# EAGLE design connector_shield (EAGLE 6.5.0)
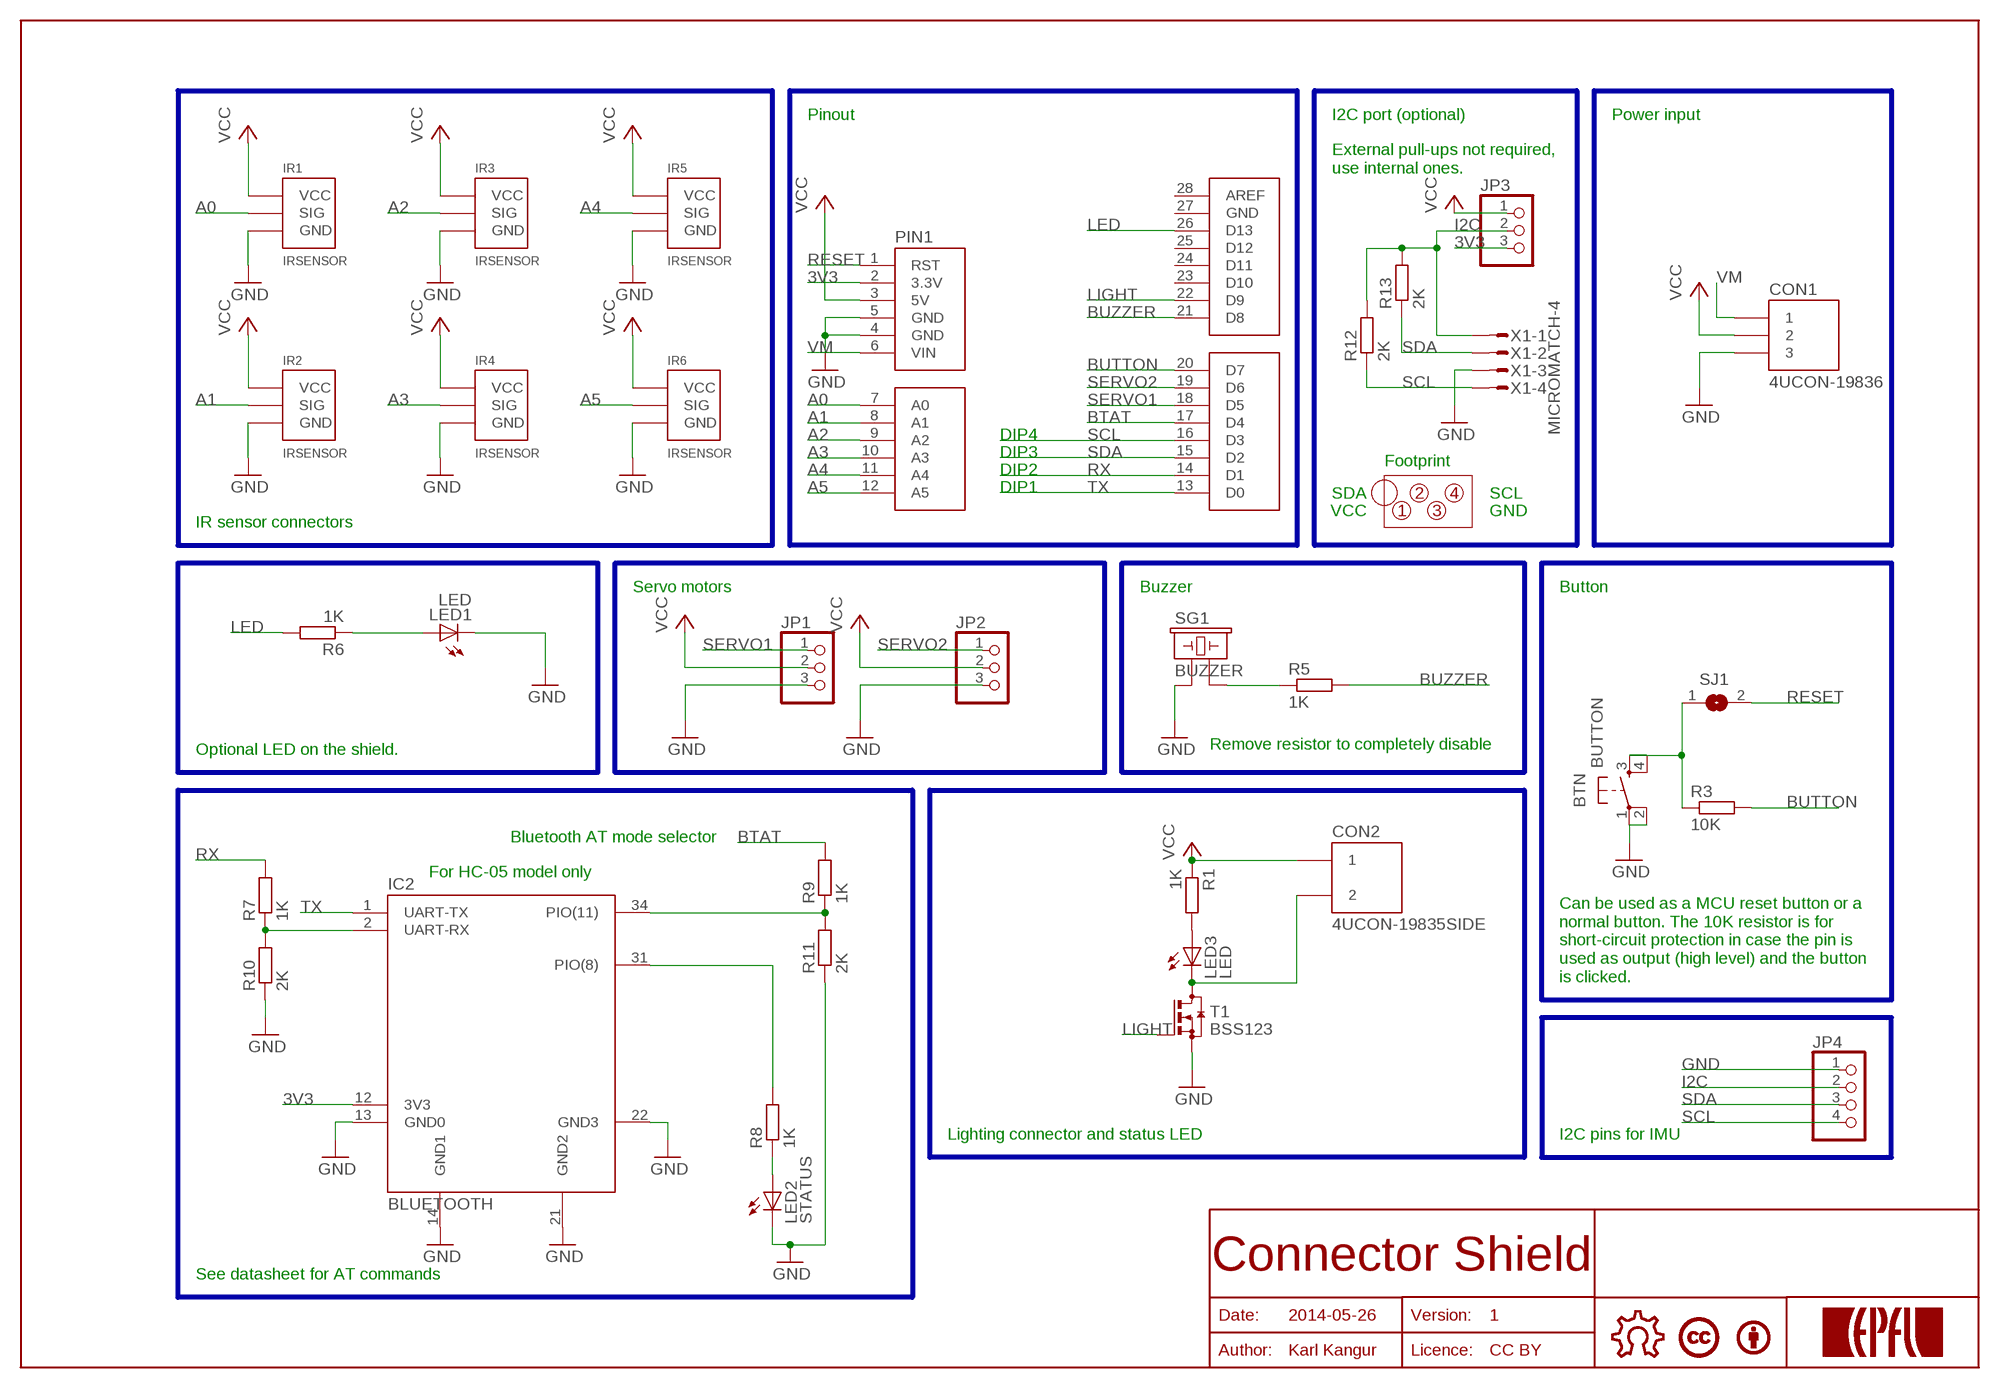
[diagram p0: schematic, sheet 1]

## Parts
BTN  BUTTON  [BUTTON]
BY1  BYBOTTOM  [BY]
CON1  4UCON-19836  [4UCON-19836]
CON2  4UCON-19835SIDE  [4UCON-19835]
IC2  BLUETOOTH  [BLUETOOTH]
IR1  IRSENSOR  [A-6373-03]
IR2  IRSENSOR  [A-6373-03]
IR3  IRSENSOR  [A-6373-03]
IR4  IRSENSOR  [A-6373-03]
IR5  IRSENSOR  [A-6373-03]
IR6  IRSENSOR  [A-6373-03]
JP1  PINHD-1X3  [1X03]
JP2  PINHD-1X3  [1X03]
JP3  PINHD-1X3  [1X03]
JP4  PINHD-1X4  [1X04]
LED1  LED  LEDCHIPLED_0805  [CHIPLED_0805]
LED2  STATUS  LEDCHIPLED_0805  [CHIPLED_0805]
LED3  LED  LEDCHIPLED_0805  [CHIPLED_0805]
LICENCE1  LICENCECC-BOTTOM  [CREATIVE-COMMONS]
PIN1  ARDUINOSTACK  [ARDUINO-LONG]
R1  1K  R-EU_R0805  [R0805]
R3  10K  R-EU_R0805  [R0805]
R5  1K  R-EU_R0805  [R0805]
R6  1K  R-EU_R0805  [R0805]
R7  1K  R-EU_R0805  [R0805]
R8  1K  R-EU_R0805  [R0805]
R9  1K  R-EU_R0805  [R0805]
R10  2K  R-EU_R0805  [R0805]
R11  2K  R-EU_R0805  [R0805]
R12  2K  R-EU_R0805  [R0805]
R13  2K  R-EU_R0805  [R0805]
SG1  BUZZER  [PS1240P02BT]
SJ1  SJ  [SJ]
T1  BSS123  [SOT23]
U$10  OPEN-HARDWARE-LOGOBOTTOM-SMALL  [OPEN-HARDWARE-BOTTOM-SMALL]
U$11  EPFL-LOGO  [EPFL-LOGO-PCB]
X1  MICROMATCH-4  [MICROMATCH-4]

## Nets
3V3: IC2.12(3V3) JP3.3 PIN1.2(3.3V)
A0: IR1.SIG PIN1.7(A0)
A1: IR2.SIG PIN1.8(A1)
A2: IR3.SIG PIN1.9(A2)
A3: IR4.SIG PIN1.10(A3)
A4: IR5.SIG PIN1.11(A4)
A5: IR6.SIG PIN1.12(A5)
BTAT: PIN1.17(D4) R9.2
BUTTON: PIN1.20(D7) R3.2
BUZZER: PIN1.21(D8) R5.2
GND: BTN.1 BTN.2 CON1.3 IC2.13(GND0) IC2.14(GND1) IC2.21(GND2) IC2.22(GND3) IR1.GND IR2.GND IR3.GND IR4.GND IR5.GND IR6.GND JP1.3 JP2.3 JP4.1 LED1.C LED2.C PIN1.4(GND) PIN1.5(GND) R10.1 R11.1 SG1.P$1 T1.2(S) X1.3
I2C: JP3.2 JP4.2 R12.2 R13.2 X1.1
LED: PIN1.26(D13) R6.2
LIGHT: PIN1.22(D9) T1.1(G)
N$1: CON2.2 LED3.C T1.3(D)
N$2: IC2.31(PIO(8)) R8.2
N$3: LED2.A R8.1
N$4: LED3.A R1.2
N$7: R5.1 SG1.P$2
N$8: IC2.34(PIO(11)) R9.1 R11.2
N$13: LED1.A R6.1
N$18: BTN.3 BTN.4 R3.1 SJ1.1
N$27: IC2.2(UART-RX) R7.1 R10.2
RESET: PIN1.1(RST) SJ1.2
RX: PIN1.14(D1) R7.2
SCL: JP4.4 PIN1.16(D3) R12.1 X1.4
SDA: JP4.3 PIN1.15(D2) R13.1 X1.2
SERVO1: JP1.1 PIN1.18(D5)
SERVO2: JP2.1 PIN1.19(D6)
TX: IC2.1(UART-TX) PIN1.13(D0)
VCC: CON1.2 CON2.1 IR1.VCC IR2.VCC IR3.VCC IR4.VCC IR5.VCC IR6.VCC JP1.2 JP2.2 JP3.1 PIN1.3(5V) R1.1
VM: CON1.1 PIN1.6(VIN)
Unconnected: PIN1.23(D10) PIN1.24(D11) PIN1.25(D12) PIN1.28(AREF)

## Buses
B$1
B$2
B$7
B$8
B$9
B$11
B$12
B$4
B$3
B$5

## Notes on the sheet
- Pinout | I2C port (optional) | Power input
- External pull-ups not required,
  use internal ones.
- DIP4
- DIP3
- Footprint
- DIP2
- DIP1 | SDA | 2 | 4 | SCL
- VCC | 1 | 3 | GND
- IR sensor connectors
- Servo motors | Buzzer | Button
- Remove resistor to completely disable
- Optional LED on the shield.
- Bluetooth AT mode selector
- For HC-05 model only
- Can be used as a MCU reset button or a
  normal button. The 10K resistor is for
  short-circuit protection in case the pin is
  used as output (high level) and the button
  is clicked.
- Lighting connector and status LED | I2C pins for IMU
- Connector Shield
- See datasheet for AT commands
- Date: | 2014-05-26 | Version: | 1
- Author: | Karl Kangur | Licence: | CC BY

## Power pins joined to a net without a drawn wire
GND: PIN1.27(GND)

## Library data of the parts
BTN = robopoly:BUTTON
BY1 = robopoly:BY
CON1 = robopoly:4UCON-19836
CON2 = karl_new:4UCON-19835
IC2 = robopoly:BLUETOOTH
IR1-IR6 = karl_new:IRSENSOR
JP1 JP2 = robopoly:PINHD-1X3: PIN HEADER
JP3 = pinhead:PINHD-1X3: PIN HEADER
JP4 = pinhead:PINHD-1X4: PIN HEADER
LED1-LED3 = led:LED: LED OSRAM: - CHIPLED LG R971, LG N971, LY N971, LG Q971, LY Q971, LO R971, LY R971 LH N974, LH R974 LS Q976, LO Q976, LY Q976 LO Q996 - Hyper CHIPLED LW Q18S LB Q993, LB Q99A, LB R99A - SideLED LS A670, LO A670, LY A670, LG A670, LP A670 LB A673, LV A673, LT A673, LW A673 LH A674 LY A675 LS A676, LA A676, LO A676, LY A676, LW A676 LS A679, LY A679, LG A679 - Hyper Micro SIDELED® LS Y876, LA Y876, LO Y876, LY Y876 LT Y87S - SmartLED LW L88C, LW L88S LB L89C, LB L89S, LG L890 LS L89K, LO L89K, LY L89K LS L896, LA L896, LO L896, LY L896 - TOPLED LS T670, LO T670, LY T670, LG T670, LP T670 LSG T670, LSP T670, LSY T670, LOP T670, LYG T670 LG T671, LOG T671, LSG T671 LB T673, LV T673, LT T673, LW T673 LH T674 LS T676, LA T676, LO T676, LY T676, LB T676, LH T676, LSB T676, LW T676 LB T67C, LV T67C, LT T67C, LS T67K, LO T67K, LY T67K, LW E67C LS E67B, LA E67B, LO E67B, LY E67B, LB E67C, LV E67C, LT E67C LW T67C LS T679, LY T679, LG T679 LS T770, LO T770, LY T770, LG T770, LP T770 LB T773, LV T773, LT T773, LW T773 LH T774 LS E675, LA E675, LY E675, LS T675 LS T776, LA T776, LO T776, LY T776, LB T776 LHGB T686 LT T68C, LB T68C - Hyper Mini TOPLED® LB M676 - Mini TOPLED Santana® LG M470 LS M47K, LO M47K, LY M47K Source: http://www.osram.convergy.de LUXEON: - LUMILED® LXK2-PW12-R00, LXK2-PW12-S00, LXK2-PW14-U00, LXK2-PW14-V00 LXK2-PM12-R00, LXK2-PM12-S00, LXK2-PM14-U00 LXK2-PE12-Q00, LXK2-PE12-R00, LXK2-PE12-S00, LXK2-PE14-T00, LXK2-PE14-U00 LXK2-PB12-K00, LXK2-PB12-L00, LXK2-PB12-M00, LXK2-PB14-N00, LXK2-PB14-P00, LXK2-PB14-Q00 LXK2-PR12-L00, LXK2-PR12-M00, LXK2-PR14-Q00, LXK2-PR14-R00 LXK2-PD12-Q00, LXK2-PD12-R00, LXK2-PD12-S00 LXK2-PH12-R00, LXK2-PH12-S00 LXK2-PL12-P00, LXK2-PL12-Q00, LXK2-PL12-R00 Source: www.luxeon.com KINGBRIGHT: KA-3528ASYC Source: www.kingbright.com
LICENCE1 = robopoly:LICENCE
PIN1 = robopoly:ARDUINO
R1 R3 R5-R13 = rcl:R-EU_: RESISTOR, European symbol
SG1 = robopoly:BUZZER: BUZZER Source: Buerklin; OC_FARNELL: unknown; OC_NEWARK: unknown
SJ1 = robopoly:SJ: SMD solder JUMPER
T1 = transistor-small-signal:BSS123: N-CHANNEL MOS FET
U$10 = robopoly:OPEN-HARDWARE-LOGO
U$11 = robopoly:EPFL-LOGO
X1 = robopoly:MICROMATCH-4: MicroMaTch 4 7-215464-4 / 0-215464-4 Drawing Number C-215464 DDEController.pdf; MPN: 7-215464-4; OC_FARNELL: 3784629; OC_NEWARK: 19R8124

## Board
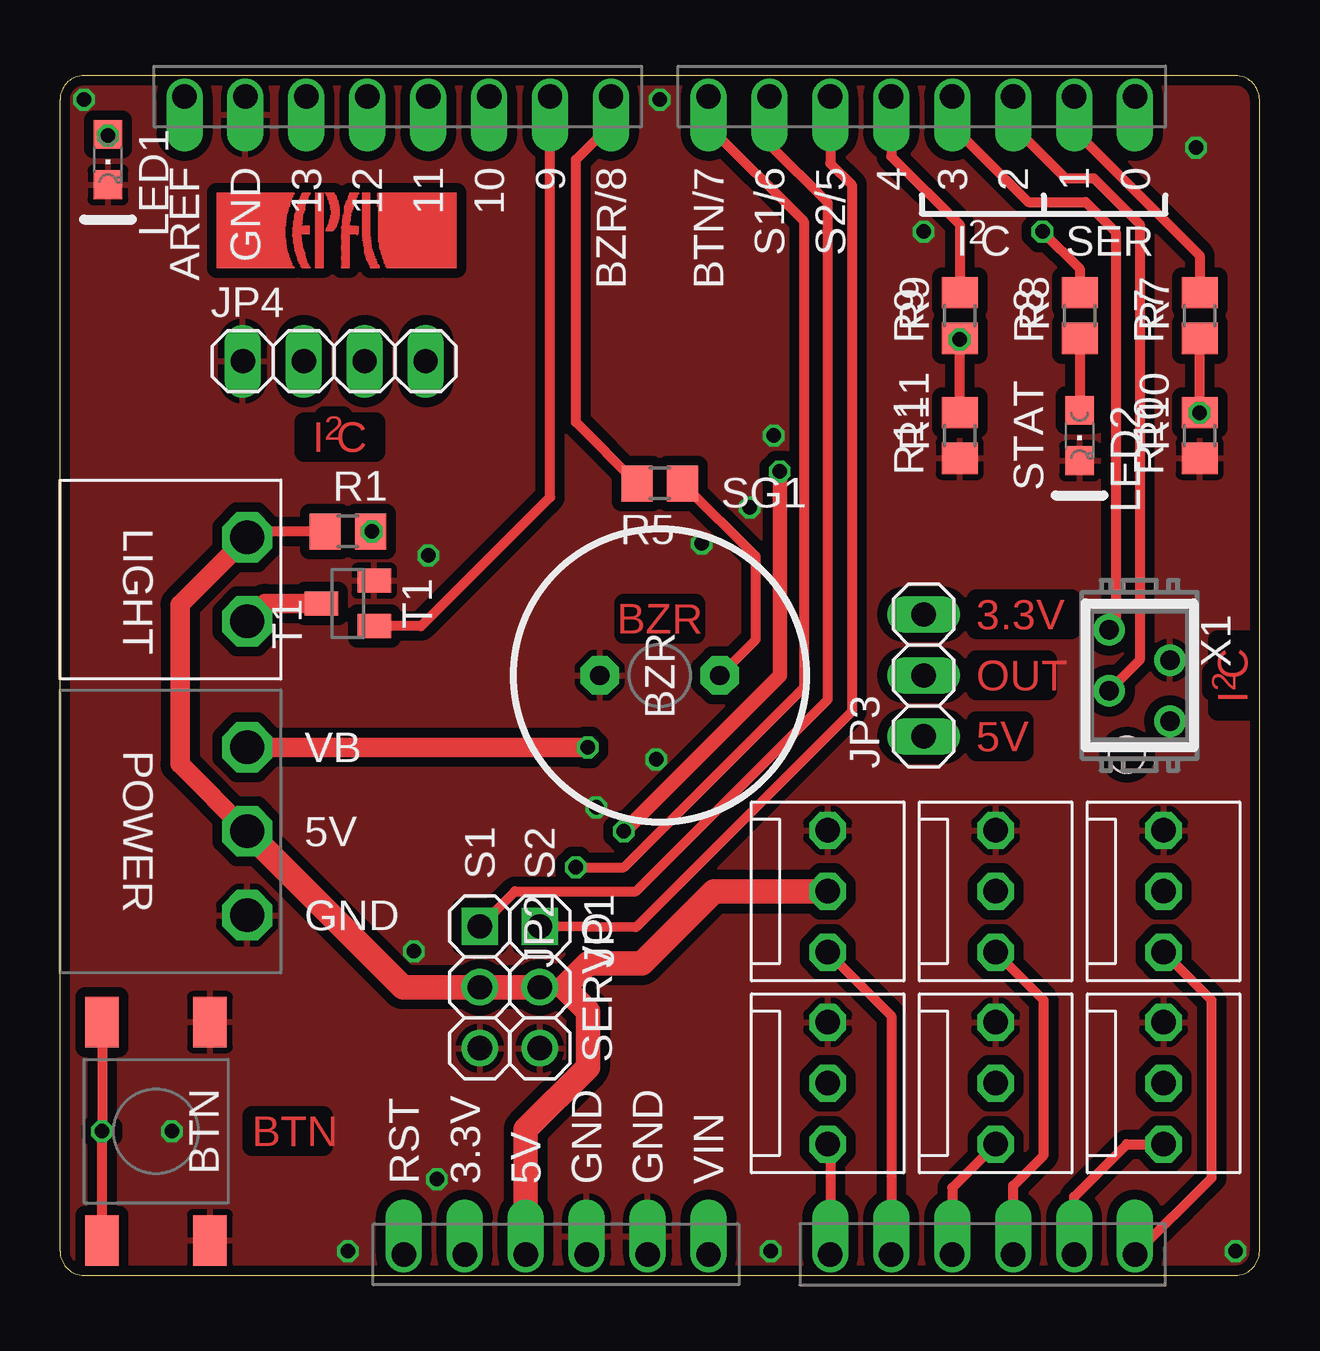
[diagram p1: board, top side]
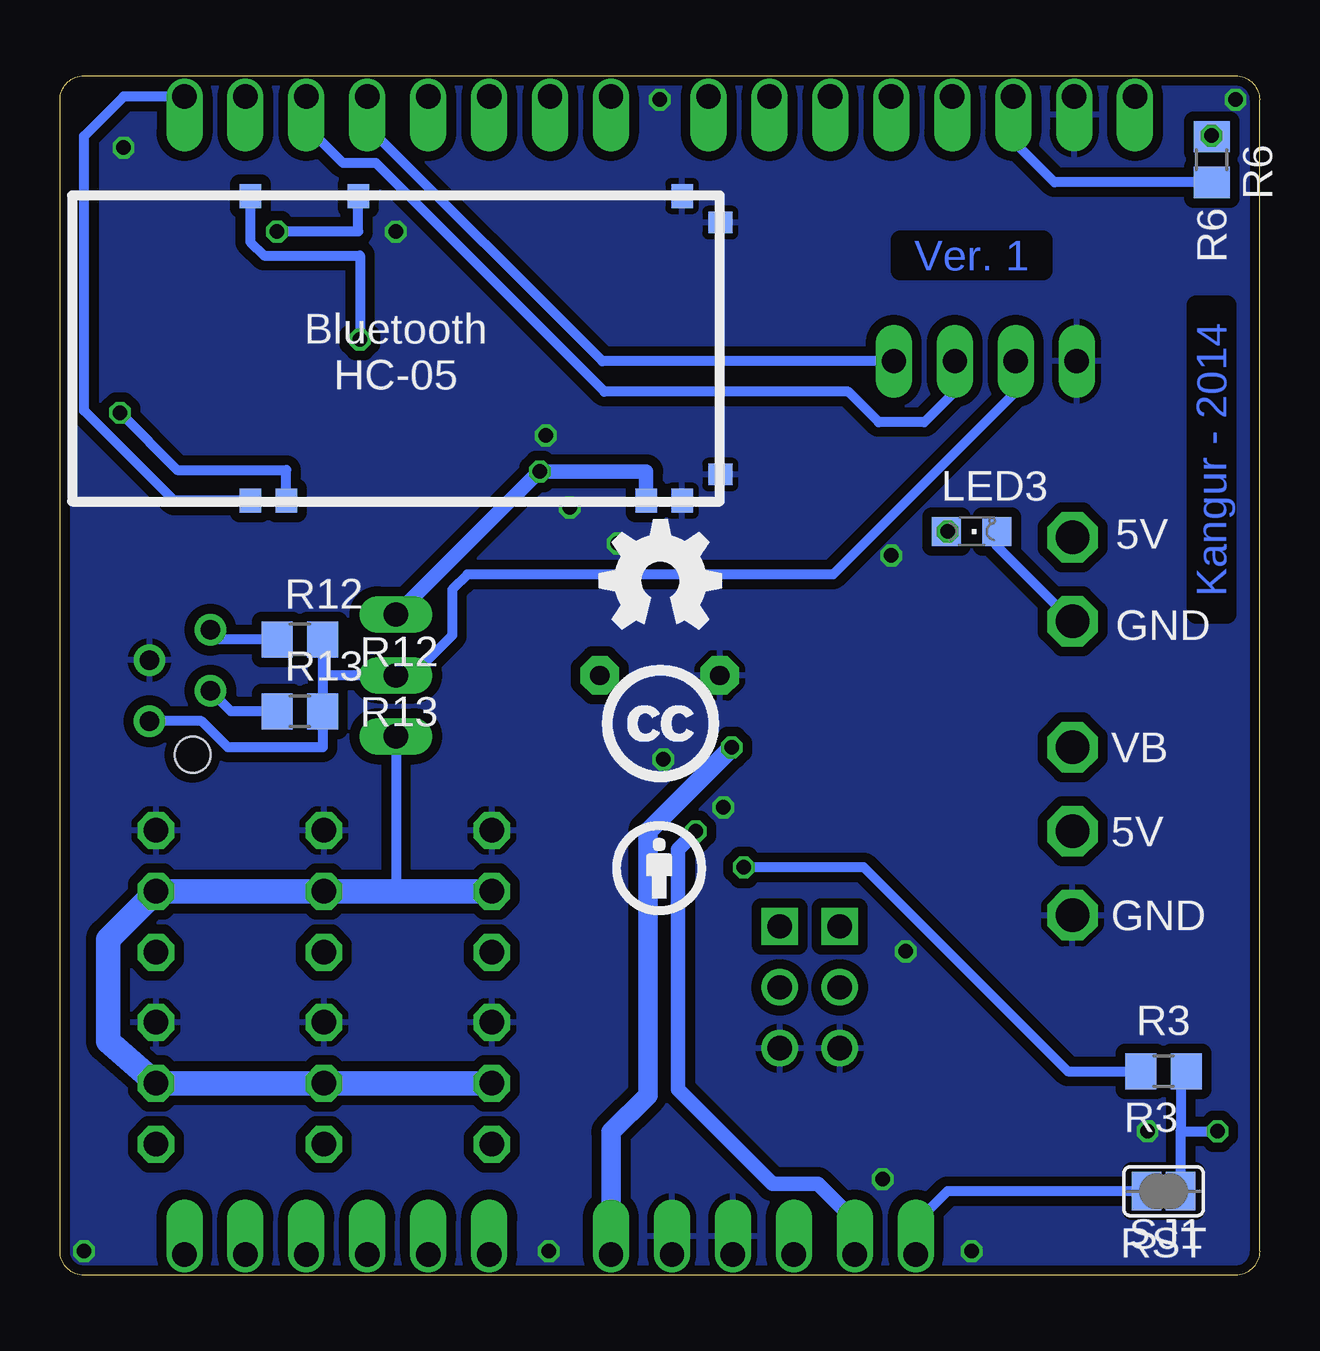
[diagram p2: board, bottom side, seen from below]

Size 50 x 50 mm. Coordinates in mm from the lower left corner, seen from the top.
Outline: 0,1 arc90 1,0 49,0 arc90 50,1 50,49 arc90 49,50 1,50 arc90 0,49 0,1
Copper layers (1*16): Top 0.035mm / dielectric 1.5mm / Bottom 0.035mm
Design rules "Fusion_eagle_rule_v1.1 *": minimum track width 0.1mm, minimum drill 0.3mm, track to track 0.15mm, track to pad 0.15mm, pad to pad 0.15mm, via to via 0.15mm, smd to smd 0mil, copper to edge 4mil, drill to drill 10mil, minimum pad ring 10mil, minimum via ring 6mil, stop-mask expansion 2mil, vias tented up to drill 100mil, thermal gap 10mil

### Footprints (pad centres in the part's own frame; a part is rotated, then mirrored left to right if it is on the bottom)
BUTTON = smd 1.4 x 2.1: 1 2.25,4.55; 2 2.25,-4.55; 3 -2.25,4.55; 4 -2.25,-4.55
4UCON-19836 = drill 1.4 octagon: 1 -3.5,7.8; 2 0,7.8; 3 3.5,7.8
4UCON-19835 = drill 1.4 octagon: 1 -1.75,7.8; 2 1.75,7.8
BLUETOOTH = smd 1 x 0.9: 1 -6.4,9.5; 2 -6.4,8; 12 -6.4,-7; 13 -6.4,-8.5; 22 6.3,-8.5; 31 6.3,5; 34 6.3,9.5 | smd 0.9 x 1: 14 -5.3,-10.1; 21 5.2,-10.1
A-6373-03 = drill 1.02 octagon: GND 2.54,0; SIG -2.54,0; VCC 0,0
1X03 = drill 1.016 square: 1 -2.54,0 | drill 1.016: 2 0,0; 3 2.54,0
1X03' = drill 1.016 long: 1 -2.54,0; 2 0,0; 3 2.54,0
1X04 = drill 1.016 long: 1 -3.81,0; 2 -1.27,0; 3 1.27,0; 4 3.81,0
CHIPLED_0805 = smd 1.2 x 1.2: A 0,-1.05; C 0,1.05
ARDUINO-LONG = drill 1.016 offset: 1 -10.668,-24.13; 2 -8.128,-24.13; 3 -5.588,-24.13; 4 -3.048,-24.13; 5 -0.508,-24.13; 6 2.032,-24.13; 7 7.112,-24.13; 8 9.652,-24.13; 9 12.192,-24.13; 10 14.732,-24.13; 11 17.272,-24.13; 12 19.812,-24.13; 13 19.812,24.13; 14 17.272,24.13; 15 14.732,24.13; 16 12.192,24.13; 17 9.652,24.13; 18 7.112,24.13; 19 4.572,24.13; 20 2.032,24.13; 21 -2.032,24.13; 22 -4.572,24.13; 23 -7.112,24.13; 24 -9.652,24.13; 25 -12.192,24.13; 26 -14.732,24.13; 27 -17.272,24.13; 28 -19.812,24.13
R0805 = smd 1.3 x 1.5: 1 -0.95,0; 2 0.95,0
PS1240P02BT = drill 0.8 pad 1.6 octagon: P$1 -2.5,0; P$2 2.5,0
SJ = smd 1.219 x 1.6: 1 -0.711,0; 2 0.711,0
SOT23 = smd 1 x 1.4: 1 -0.95,-1.1; 2 0.95,-1.1; 3 0,1.1
MICROMATCH-4 = drill 0.813: 1 1.905,1.27; 2 0.635,-1.27; 3 -0.635,1.27; 4 -1.905,-1.27 | hole 1.5: 3.305,-0.53

### Placement (x,y rotation side)
BTN  4,6 0 top
BY1  25,17 0 top
CON1  0,18.5 270 top
CON2  0,29 270 top
IC2  32.57,38.68 90 bottom
IR1  32,8 90 top
IR2  32,16 90 top
IR3  39,8 90 top
IR4  39,16 90 top
IR5  46,8 90 top
IR6  46,16 90 top
JP1  20,12 270 top
JP2  17.5,12 270 top
JP3  [1X03']  36,25 90 top
JP4  11.43,38.1 0 top
LED1  2,46.5 180 top
LED2  42.5,35 180 top
LED3  12,31 270 bottom
LICENCE1  25,23 0 top
PIN1  25,25 0 top
R1  12,31 0 top
R3  4,8.5 180 bottom
R5  25,33 180 top
R6  2,46.5 270 bottom
R7  47.5,40 90 top
R8  42.5,40 90 top
R9  37.5,40 90 top
R10  47.5,35 90 top
R11  37.5,35 90 top
R12  40,26.5 0 bottom
R13  40,23.5 0 bottom
SG1  25,25 0 top
SJ1  4,3.5 180 bottom
T1  12,28 90 top
U$10  25,29 0 top
U$11  6.55,42 0 top
X1  45,25 270 top

### Tracks (layer width: path | path; a pad name or v marks a point on that pad's centre or on a via)
3V3  (via drill 0.6)
  Top 0.61: v23.5,18.5 30,25 v30,33.5
  Bottom 0.406: 30.04,33.5 v30,33.5
  Bottom 0.61: IC2.12 25.57,33.5 v30,33.5 | v23.5,18.5 24.25,17.75 24.25,7.75 20.31,3.81 18.41,3.81 16.87,2.27 PIN1.2 | JP3.3 30.04,33.5
A0
  Top 0.406: IR1.SIG 32.11,5.35 PIN1.7
A1
  Top 0.406: IR2.SIG 34.65,10.81 PIN1.8
A2
  Top 0.406: IR3.SIG 37.19,3.65 PIN1.9
A3
  Top 0.406: PIN1.10 39.73,3.73 41,5 41,11.46 IR4.SIG
A4
  Top 0.406: PIN1.11 42.27,3.27 44.46,5.46 IR5.SIG
A5
  Top 0.406: PIN1.12 48,4.06 48,11.46 IR6.SIG
BTAT
  Top 0.406: PIN1.17 34.65,46.63 37.5,43.78 R9.2
BUTTON  (via drill 0.6)
  Top 0.406: v21.5,17 23.5,17 31,24.5 31,43.93 27.03,47.9 PIN1.20
  Bottom 0.406: R3.2 8,8.5 16.5,17 v21.5,17
BUZZER
  Top 0.406: R5.2 21.5,35.55 21.5,46.5 23,48 23,49.1 PIN1.21
GND  (via drill 0.6)
  other vias: 29.62,1 25,49 47.35,47 49,1 1,49 4.66,6 36,43.5 29.75,35 15.71,4 12,1 14.75,13.5 15.35,30 22.35,19.5 24.85,21.5 28.75,32 26.75,30.5
  pour Top (isolate 0.406, rank 2): 49,0 1,0 arc-90 0,1 0,49 arc-90 1,50 49,50 arc-90 50,49 50,1 arc-90
  pour Bottom (isolate 0.406, rank 2): 49,0 1,0 arc-90 0,1 0,49 arc-90 1,50 49,50 arc-90 50,49 50,1 arc-90
I2C
  Bottom 0.406: R12.2 39.05,25 | 39.05,25 R13.2 39.05,22 43,22 44.09,23.09 X1.1 | 39.05,25 JP3.2 35.33,25 33.66,26.67 33.66,28.57 33.02,29.21 17.78,29.21 10.16,36.83 JP4.2
LED
  Bottom 0.406: R6.2 8.55,45.55 10.27,47.27 PIN1.26
LIGHT
  Top 0.406: PIN1.22 20.43,32.43 15.05,27.05 T1.1
N$1
  Top 0.813: CON2.2 8.55,28 T1.3
  Bottom 0.406: LED3.C 10.95,30.4 CON2.2
N$2  (via drill 0.6)
  Top 0.406: v40.95,43.5 42.5,41.95 R8.2
  Bottom 0.406: v40.95,43.5 37.57,43.5 IC2.31
N$3
  Top 0.406: R8.1 LED2.A
N$4  (via drill 0.6)
  Top 0.406: R1.2 v13,31
  Bottom 0.406: LED3.A v13,31
N$7
  Top 0.406: R5.1 29,29.95 29,26.5 SG1.P$2
N$8  (via drill 0.6)
  Top 0.406: R11.2 v37.5,39 R9.1
  Bottom 0.406: IC2.34 42.07,43.07 41.5,42.5 37.5,42.5 v37.5,39
N$13  (via drill 0.6)
  Top 0.406: v2,47.5 LED1.A
  Bottom 0.406: R6.1 v2,47.5
N$18  (via drill 0.6)
  Top 0.406: BTN.4 v1.75,6 BTN.3
  Bottom 0.406: SJ1.1 3.29,6 | 3.29,6 v1.75,6 | R3.1 3.29,8.26 3.29,6
N$27  (via drill 0.6)
  Top 0.406: R10.2 R7.1
  Bottom 0.406: IC2.2 40.57,33.57 45.12,33.57 R10.2
  other vias: 47.5,35.95
RESET
  Bottom 0.406: PIN1.1 14.33,2.18 13.01,3.5 SJ1.2
RX
  Top 0.406: PIN1.14 42.27,47.73 47.5,42.5 R7.2
SCL
  Top 0.406: PIN1.16 37.19,47.9 40.36,44.73 42.75,44.73 44,43.48 44,27.18 X1.4
  Bottom 0.406: R12.1 43.33,26.5 X1.4 | JP4.4 27.39,38.1 37.19,47.9 PIN1.16
SDA
  Top 0.406: PIN1.15 39.73,47.9 41.91,45.72 43.09,45.72 45,43.81 45,25.64 X1.2
  Bottom 0.406: R13.1 42.87,23.5 X1.2 | JP4.3 12.7,36.83 13.97,35.56 15.88,35.56 17.14,36.83 27.3,36.83 36.83,46.35 38.19,46.35 39.73,47.9 PIN1.15
SERVO1
  Top 0.406: JP1.1 24,14.5 33,23.5 33,45.45 32.11,46.34 PIN1.18
SERVO2
  Top 0.406: JP2.1 18.96,16 24,16 32,24 32,44.7 29.57,47.13 PIN1.19
TX
  Bottom 0.406: PIN1.13 47.35,49.13 49,47.48 49,36.03 45.25,32.28 IC2.1
VCC
  Top 0.406: 14.3,12 14,12 13.15,12.85 13.15,13.15 | R1.1 8.05,31 CON2.1
  Top 0.813: JP2.2 JP1.2 21,12 | CON2.1 5,27.95 5,21.3 CON1.2
  Top 1.016: CON1.2 13.15,13.15 14.3,12 JP1.2 | PIN1.3 19.41,6.08 22,8.66 22,11 21,12 22,13 24.25,13 27.25,16 IR2.VCC
  Bottom 0.406: IR6.VCC 43,16 | JP3.1 36,16
  Bottom 1.016: IR1.VCC IR3.VCC IR5.VCC 48,9.75 48,14 IR6.VCC IR4.VCC 36,16 IR2.VCC
VM  (via drill 0.6)
  Top 0.813: v22,22 CON1.1
  Bottom 0.813: v22,22 25.5,18.5 25.5,7.5 27.03,5.97 PIN1.6

### Text on the board
Top: 2 | I C | BZR | 3.3V | OUT | 2 | I C | 5V | BTN
Bottom: Ver. 1 | Kangur - 2014
tPlace: AREF | GND | 13 | 12 | 11 | 10 | 9 | BZR/8 | BTN/7 | S1/6 | S2/5 | 4 | 3 | 2 | 1 | 0 | 2 | I C | SER | R9 | R8 | R7 | R11 | STAT | R10 | LIGHT | T1 | BZR | VB | POWER | 5V | S1 | S2 | GND | SERVO | BTN | RST | 3.3V | 5V | GND | GND | VIN
bPlace: R6 | Bluetooth / HC-05 | 5V | GND | R12 | R13 | VB | 5V | GND | R3 | RST
Document: Connector Shield | Version: 1 | Licence: CC-BY | 2014-05-26